# EasyEDA Pro project ProPrj_遥控_2025-12-06.epro, board OLED_1
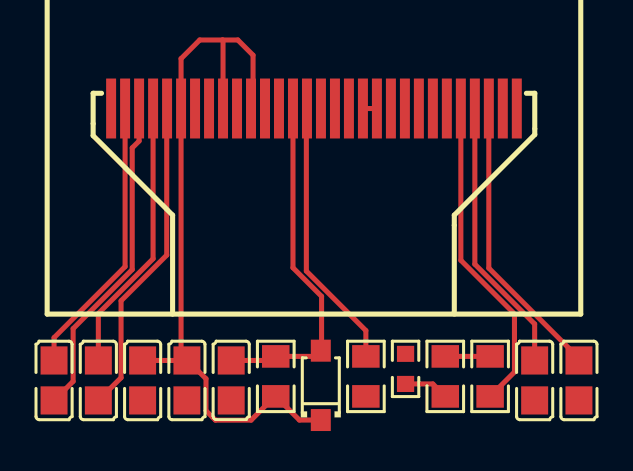
[diagram p13: board, top side]
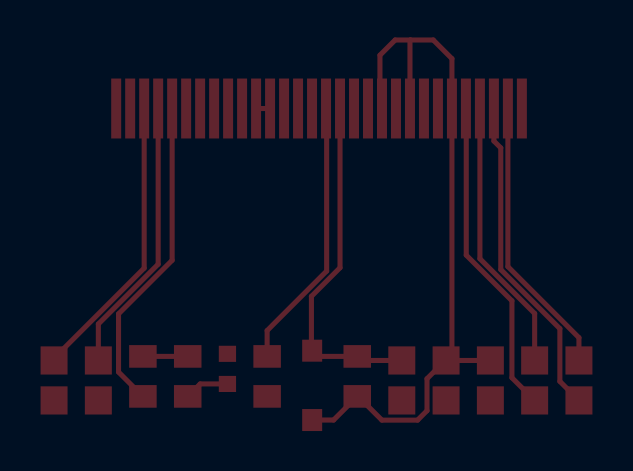
[diagram p14: board, bottom side, seen from below]

No outline. copper layers: Top Layer, Bottom Layer. Coordinates in mm from the lowest, leftmost part position.
Stack: Top Layer 0.035mm / Dielectric1 1.51mm FR4 er 4.5 / Bottom Layer 0.035mm

## Design rules (mm)
template: JLCPCB Capability(Two Layers Board)
spacing copperThickness1oz (default): track to track 0.102, other pairs 0.152 to 0.3
spacing copperThickness2oz: track to track 0.203, other pairs 0.152 to 0.3
track width copperThickness1oz (default): min 0.127, default 0.254, max 2.54
track width copperThickness2oz: min 0.203, default 0.254, max 2.54
differential pair differentialPair (default): width min 0.127, default 0.254, max 2.54; gap min 0.152, default 0.152
via viaSize (default): diameter min 0.5, default 0.61, max 10; hole min 0.3, default 0.305, max 6.3

## Placement (name value [footprint] x y rotation side)
C1  1uF  [C0805]  0 0.25 90 top
C2  1uF  [C0805]  2.22 0.25 90 top
C3  1uF  [C0805]  6.65 0.25 270 top
C4  1uF  [C0805]  4.43 0.25 270 top
C5  1uF  [C0805]  8.86 0.25 270 top
C6  4.7uF  [C0805]  24.05 0.25 90 top
C7  2.2uF  [C0805]  26.26 0.25 270 top
D1  1N4148W  [SOD-123F_L2.7-W1.6-LS3.8-RD]  13.35 0 90 top
OLED1  X096-2864TMBAG01-H30  [OLED-SMD_X096-2864TMBAG01-H30]  13 13.85 0 top
R1  4.7kΩ  [R0805]  11.09 0.45 270 top
R2  4.7kΩ  [R0805]  15.6 0.45 270 top
R3  510kΩ  [R0603]  17.59 0.82 270 top
R4  200kΩ  [R0805]  19.58 0.45 90 top
R5  200kΩ  [R0805]  21.82 0.45 270 top

## Footprints (pads in the part's own frame, mm; a bottom-side part is the same pattern mirrored in y, then rotated)
C0805
  rect 1.41x1.35 smd: 1(-1,0) 2(1,0)
OLED-SMD_X096-2864TMBAG01-H30
  rect 0.5x3 smd: 1(-10.15,0) 2(-9.45,0) 3(-8.75,0) 4(-8.05,0) 5(-7.35,0) 6(-6.65,0) 7(-5.95,0) 8(-5.25,0) 9(-4.55,0) 10(-3.85,0) 11(-3.15,0) 12(-2.45,0) 13(-1.75,0) 14(-1.05,0) 15(-0.35,0) 16(0.35,0) 17(1.05,0) 18(1.75,0) 19(2.45,0) 20(3.15,0) 21(3.85,0) 22(4.55,0) 23(5.25,0) 24(5.95,0) 25(6.65,0) 26(7.35,0) 27(8.05,0) 28(8.75,0) 29(9.45,0) 30(10.15,0)
R0603
  rect 0.806x0.864 smd: 1(-0.753,0) 2(0.753,0)
R0805
  rect 1.133x1.377 smd: 1(-1,0) 2(1,0)
SOD-123F_L2.7-W1.6-LS3.8-RD
  rect 1.1x1 smd: 1(-1.735,0) 2(1.735,0)

## Nets
As in the schematic.

Pads without a net: OLED1 7

## Routing (per net, layer and track width the routed paths; a pad name or vN(x,y) marks a point on that pad's centre or on a via; arc(x,y) is an arc through that point)
VCC: length 37.7
  Top Layer w0.254: 8.43,17.28 7.29,17.28 6.35,16.35 OLED1.6 6.35,1.54 C3.1 ; 8.43,17.28 9.19,17.28 9.96,16.52 9.96,13.95 OLED1.11 ; 8.43,17.28 8.45,17.26 OLED1.9 ; C4.1 C3.1 ; C3.1 6.69,1.25 7.6,0.33 7.6,-1.27 8.07,-1.74 9.86,-1.74 11.05,-0.55 R1.2 12.28,-1.73 13.35,-1.73
OLED_SDA: length 0.7
  Top Layer w0.254: OLED1.19 OLED1.20
RES: length 17.4
  Top Layer w0.254: C5.1 10.89,1.25 R1.1 13.06,1.45 D1.2 13.39,1.77 13.39,4.45 11.95,5.88 OLED1.14
$1N581: length 14.5
  Top Layer w0.254: C7.1 26.26,1.35 21.75,5.86 OLED1.28
$1N735: length 13.8
  Top Layer w0.254: C6.2 24.05,3.07 21.06,6.06 OLED1.27
$1N818: length 16
  Top Layer w0.254: OLED1.26 20.35,6.26 23.04,3.57 23.04,0.67 R5.2
$1N1344: length 16
  Top Layer w0.254: C2.1 3.35,0.38 3.35,4.23 5.64,6.52 5.64,13.84 OLED1.5
$1N1347: length 16.4
  Top Layer w0.254: OLED1.3 4.25,12.23 3.91,11.88 3.91,5.79 0.95,2.84 0.95,0.2 C1.1
$1N1351: length 13.7
  Top Layer w0.254: OLED1.4 4.95,6.34 2.22,3.6 C2.2
$1N1361: length 14.1
  Top Layer w0.254: OLED1.2 3.56,5.94 0,2.39 C1.2
$1N2501: length 2.2
  Top Layer w0.254: R3.2 18.95,0.07 R4.1
$1N2540: length 2.2
  Top Layer w0.254: R4.2 R5.1
$1N3248: length 13.7
  Top Layer w0.254: R2.1 15.6,2.74 12.62,5.72 12.62,13.82 OLED1.15
